# EAGLE schematic 301_ble_siliconlabs (EAGLE 7.6.0)
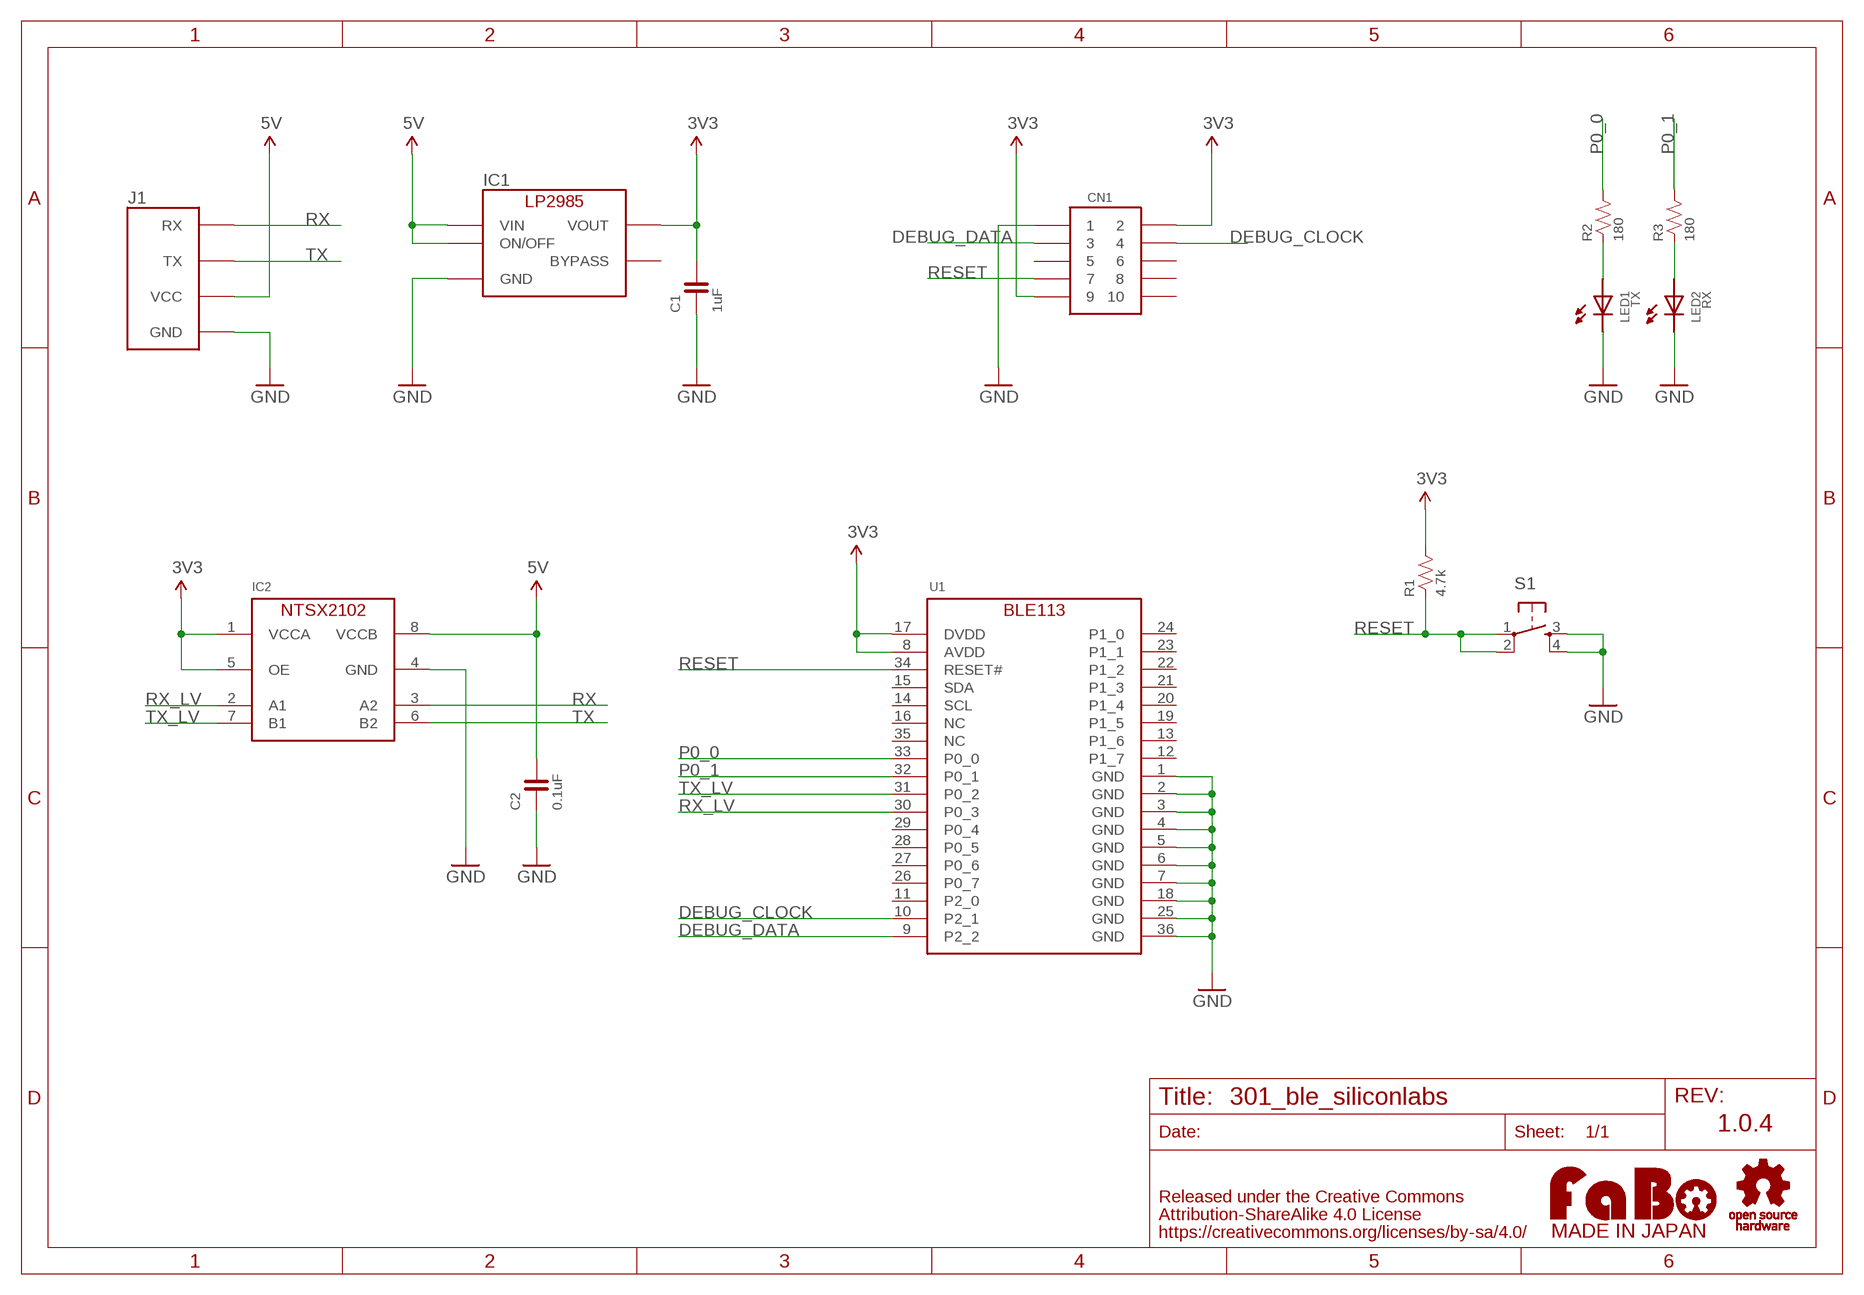
[diagram p0: schematic, sheet 1]

## Parts
C1  1uF  CAPACITOR-0603  [0603]
C2  0.1uF  CAPACITOR-0603  [0603]
CN1  PIN-HEADER-SMT(1.27MM)2X5  [PIN-HEADER-SMT(1.27MM)2X5]
IC1  LP2985-33DBV  [SOT-23-5]
IC2  NTSX2102GU8H  [SOT1309-1]
J1  FABO_BRICK_SERIAL  [FABO_BRICK_SERIAL]
LED1  TX  LED-0603  [0603]
LED2  RX  LED-0603  [0603]
R1  4.7k  RESISTOR-0603  [0603]
R2  180  RESISTOR-0603  [0603]
R3  180  RESISTOR-0603  [0603]
S1  TACT-SWITCH-SMD_KMR2  [KMR2]
U1  BLUEGIGA-BLE113  [BLUEGIGA-BLE113]
U$2  LOGO_OSHW-M_BOTTOM  [LOGO_OSHW_M_BOTTOM]
U$3  LOGO_FABO-M_BOTTOM  [LOGO_FABO_MS_BOTTOM]

## Nets
3V3: C1.2 CN1.2 CN1.9 IC1.5(VOUT) IC2.1(VCCA) IC2.5(OE) R1.2 U1.8(AVDD) U1.17(DVDD)
5V: C2.2 IC1.1(VIN) IC1.3(ON/OFF) IC2.8(VCCB) J1.VCC
DEBUG_CLOCK: CN1.4 U1.10(P2_1)
DEBUG_DATA: CN1.3 U1.9(P2_2)
GND: C1.1 C2.1 CN1.1 IC1.2(GND) IC2.4(GND) J1.GND LED1.CATHODE LED2.CATHODE S1.3 S1.4 U1.1(GND) U1.2(GND) U1.3(GND) U1.4(GND) U1.5(GND) U1.6(GND) U1.7(GND) U1.18(GND) U1.25(GND) U1.36(GND)
N$1: LED1.ANODE R2.1
N$2: LED2.ANODE R3.1
P0_0: R2.2 U1.33(P0_0)
P0_1: R3.2 U1.32(P0_1)
RESET: CN1.7 R1.1 S1.1 S1.2 U1.34(RESET#)
RX: IC2.3(A2) J1.RX
RX_LV: IC2.2(A1) U1.30(P0_3)
TX: IC2.6(B2) J1.TX
TX_LV: IC2.7(B1) U1.31(P0_2)
Unconnected: CN1.5 CN1.6 CN1.8 CN1.10 IC1.4(BYPASS) U1.11(P2_0) U1.12(P1_7) U1.13(P1_6) U1.14(SCL) U1.15(SDA) U1.16(NC) U1.19(P1_5) U1.20(P1_4) U1.21(P1_3) U1.22(P1_2) U1.23(P1_1) U1.24(P1_0) U1.26(P0_7) U1.27(P0_6) U1.28(P0_5) U1.29(P0_4) U1.35(NC)

## Notes on the sheet
- 1.0.4

## Library data of the parts
C1 C2 = FaBo-Capacitor:CAPACITOR: CAPACITOR
CN1 = FaBo-etc:PIN-HEADER-SMT(1.27MM)2X5: PIN-HEADER-SMT (1.27MM) 2x5
IC1 = FaBo-Supply:LP2985: LP2985
IC2 = FaBo-LevelTranslator:NTSX2102
J1 = FaBo-Template:FABO_BRICK_SERIAL: FaBo Brick Serial
LED1 LED2 = FaBo-LED:LED
R1-R3 = FaBo-Resistors:RESISTOR: RESISTOR
S1 = FaBo-Switch:TACT-SWITCH
U1 = FaBo-BT:BLUEGIGA-BLE113: Bluegiga BLE113 Bluetooth Bluetooth 4.0 low energy radio Radio Transmit power: +0 dBm Receiver sensitivity: -93 dBm Typical line-of-sight range: 30 - 100 meters Current Consumption TX peak current: 18.2 mA, 14.3 ma (with DC/DC) RX peak current: 17.9 mA Power mode 1: 270 uA Power mode 2: 1 uA Power mode 3: 0.4 uA Certifications Japan: MIC Japan( 007-AB0103)
U$2 = FaBo-etc:LOGO_OSHW
U$3 = FaBo-etc:LOGO_FABO